# Altium schematic sheet SOM_AB.SchDoc
size A; SheetNumber: 6; SheetTotal: 9
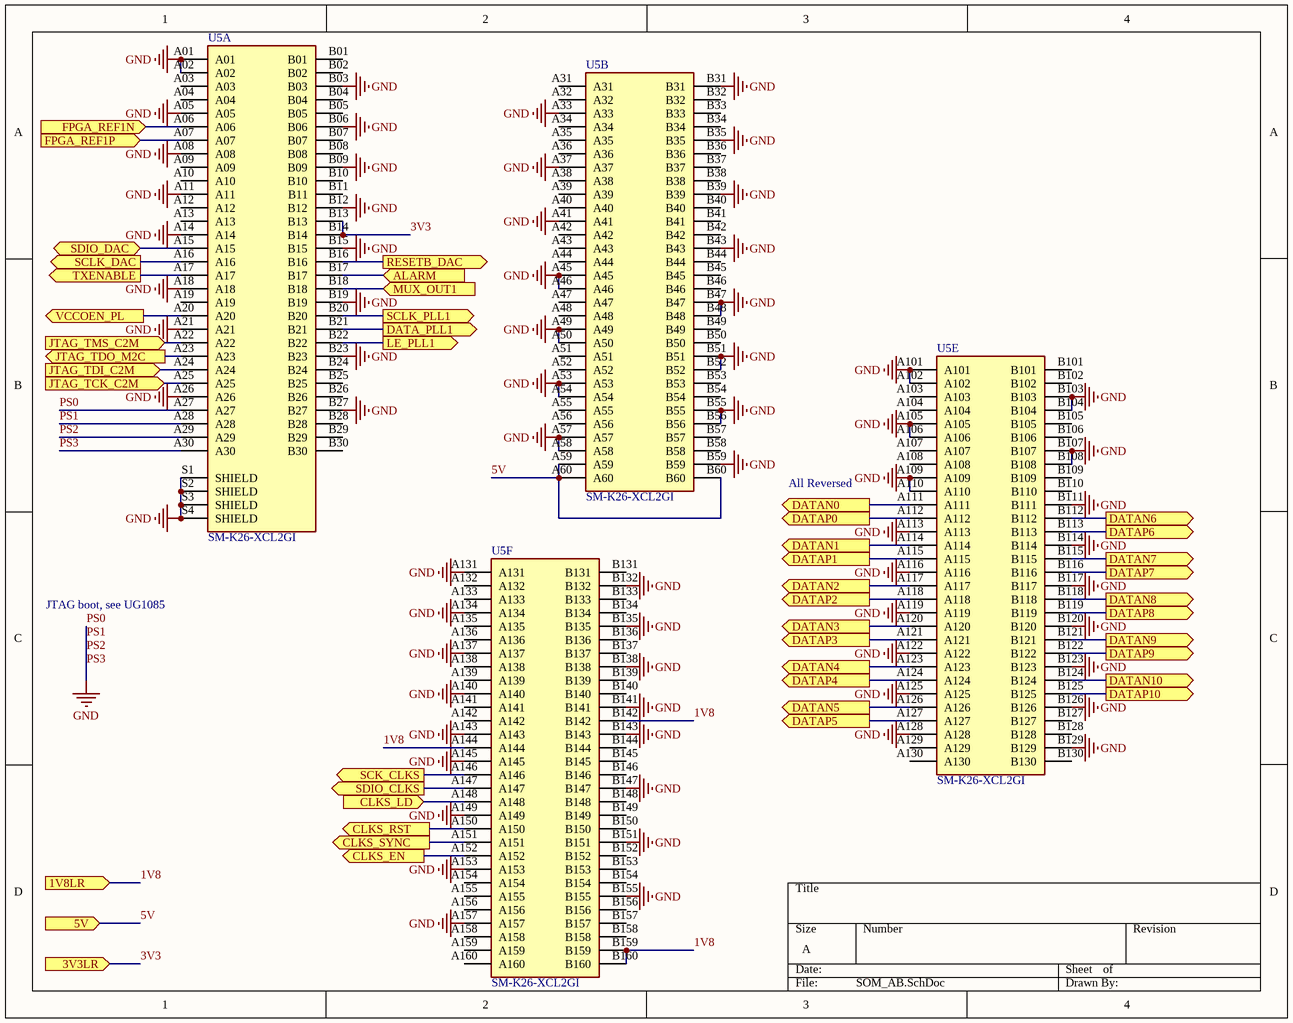
[diagram p0: SOM_AB.SchDoc]

## Parts
U5  SM-K26-XCL2GI  [MODULE_SM-K26-XCL2GI]  (parts A,B,E,F of 8)

## Ports
1V8LR (in), 3V3LR (in), 5V (in), ALARM (in), CLKS_EN (out), CLKS_LD (in), CLKS_RST (out), CLKS_SYNC (out), DATA_PLL1 (out), DATAN0 (out), DATAN1 (out), DATAN2 (out), DATAN3 (out), DATAN4 (out), DATAN5 (out), DATAN6 (out), DATAN7 (out), DATAN8 (out), DATAN9 (out), DATAN10 (out), DATAP0 (out), DATAP1 (out), DATAP2 (out), DATAP3 (out), DATAP4 (out), DATAP5 (out), DATAP6 (out), DATAP7 (out), DATAP8 (out), DATAP9 (out), DATAP10 (out), FPGA_REF1N (in), FPGA_REF1P (in), JTAG_TCK_C2M (in), JTAG_TDI_C2M (in), JTAG_TDO_M2C (out), JTAG_TMS_C2M (in), LE_PLL1 (out), MUX_OUT1 (in), RESETB_DAC (out), SCK_CLKS (out), SCLK_DAC (out), SCLK_PLL1 (out), SDIO_CLKS (out), SDIO_DAC (bidir), TXENABLE (out), VCCOEN_PL (out)

## Nets
PS0: U5.A01 U5.A02 U5.A05 U5.A08 U5.A11 U5.A14 U5.A18 U5.A21 U5.A26 U5.A27 U5.A28 U5.A29 U5.A30 U5.A33 U5.A37 U5.A41 U5.A45 U5.A46 U5.A49 U5.A50 U5.A53 U5.A54 U5.A57 U5.A58 U5.A101 U5.A102 U5.A105 U5.A106 U5.A109 U5.A110 U5.A113 U5.A116 U5.A119 U5.A122 U5.A125 U5.A128 U5.A131 U5.A134 U5.A137 U5.A140 U5.A143 U5.A145 U5.A149 U5.A153 U5.A157 U5.B03 U5.B06 U5.B09 U5.B12 U5.B15 U5.B19 U5.B23 U5.B27 U5.B31 U5.B35 U5.B39 U5.B43 U5.B47 U5.B48 U5.B51 U5.B52 U5.B55 U5.B56 U5.B59 U5.B103 U5.B104 U5.B107 U5.B108 U5.B111 U5.B114 U5.B117 U5.B120 U5.B123 U5.B126 U5.B129 U5.B132 U5.B135 U5.B138 U5.B141 U5.B143 U5.B147 U5.B151 U5.B155 U5.S1(SHIELD) U5.S2(SHIELD) U5.S3(SHIELD) U5.S4(SHIELD)  [also labelled GND, PS1, PS2, PS3]
1V8: U5.A144 U5.B142 U5.B159 U5.B160 ; port 1V8LR
3V3: U5.B13 U5.B14 ; port 3V3LR
5V: U5.A59 U5.A60 U5.B60 ; port 5V
ALARM: U5.B17 ; port ALARM
CLKS_EN: U5.A152 ; port CLKS_EN
CLKS_LD: U5.A148 ; port CLKS_LD
CLKS_RST: U5.A150 ; port CLKS_RST
CLKS_SYNC: U5.A151 ; port CLKS_SYNC
DATA_PLL1: U5.B21 ; port DATA_PLL1
DATAN0: U5.A111 ; port DATAN0
DATAN1: U5.A114 ; port DATAN1
DATAN2: U5.A117 ; port DATAN2
DATAN3: U5.A120 ; port DATAN3
DATAN4: U5.A123 ; port DATAN4
DATAN5: U5.A126 ; port DATAN5
DATAN6: U5.B112 ; port DATAN6
DATAN7: U5.B115 ; port DATAN7
DATAN8: U5.B118 ; port DATAN8
DATAN9: U5.B121 ; port DATAN9
DATAN10: U5.B124 ; port DATAN10
DATAP0: U5.A112 ; port DATAP0
DATAP1: U5.A115 ; port DATAP1
DATAP2: U5.A118 ; port DATAP2
DATAP3: U5.A121 ; port DATAP3
DATAP4: U5.A124 ; port DATAP4
DATAP5: U5.A127 ; port DATAP5
DATAP6: U5.B113 ; port DATAP6
DATAP7: U5.B116 ; port DATAP7
DATAP8: U5.B119 ; port DATAP8
DATAP9: U5.B122 ; port DATAP9
DATAP10: U5.B125 ; port DATAP10
FPGA_REF1N: U5.A06 ; port FPGA_REF1N
FPGA_REF1P: U5.A07 ; port FPGA_REF1P
JTAG_TCK_C2M: U5.A25 ; port JTAG_TCK_C2M
JTAG_TDI_C2M: U5.A24 ; port JTAG_TDI_C2M
JTAG_TDO_M2C: U5.A23 ; port JTAG_TDO_M2C
JTAG_TMS_C2M: U5.A22 ; port JTAG_TMS_C2M
LE_PLL1: U5.B22 ; port LE_PLL1
MUX_OUT1: U5.B18 ; port MUX_OUT1
RESETB_DAC: U5.B16 ; port RESETB_DAC
SCK_CLKS: U5.A146 ; port SCK_CLKS
SCLK_DAC: U5.A16 ; port SCLK_DAC
SCLK_PLL1: U5.B20 ; port SCLK_PLL1
SDIO_CLKS: U5.A147 ; port SDIO_CLKS
SDIO_DAC: U5.A15 ; port SDIO_DAC
TXENABLE: U5.A17 ; port TXENABLE
VCCOEN_PL: U5.A20 ; port VCCOEN_PL

Not connected (* = marked no-connect by the designer): U5 A03 A04 A09 A10 A12 A13 A19 A31 A32 A34 A35 A36 A38 A39 A40 A42 A43 A44 A47 A48 A51 A52 A55 A56 A103 A104 A107 A108 A129 A130 A132 A133 A135 A136 A138 A139 A141 A142 A154 A155 A156 A158 A159 A160 B01 B02 B04 B05 B07 B08 B10 B11 B24 B25 B26 B28 B29 B30 B32 B33 B34 B36 B37 B38 B40 B41 B42 B44 B45 B46 B49 B50 B53 B54 B57 B58 B101 B102 B105 B106 B109 B110 B127 B128 B130 B131 B133 B134 B136 B137 B139 B140 B144 B145 B146 B148 B149 B150 B152 B153 B154 B156 B157 B158

## Notes on the sheet
- All Reversed
- JTAG boot, see UG1085

## Library data of the parts
U5 = SM-K26-XCL2GI: ZynqÂ® UltraScale+â„¢ Kriaâ„¢ Embedded Module ARMÂ® CortexÂ®-A53 ArmÂ® CortexÂ®-R5F 533MHz, 1.333GHz 4GB 16GB eMMC, 64MB QSPI; MF: Xilinx Inc.; Package: None; SnapEDA_Link: https://www.snapeda.com/parts/SM-K26-XCL2GI/Xilinx+Inc./view-part/?ref=snap; Value: *; MP: SM-K26-XCL2GI; Check_prices: https://www.snapeda.com/parts/SM-K26-XCL2GI/Xilinx+Inc./view-part/?ref=eda; Availability: In Stock; Price: None; Purchase-URL: https://pricing.snapeda.com/search/part/SM-K26-XCL2GI/?ref=eda